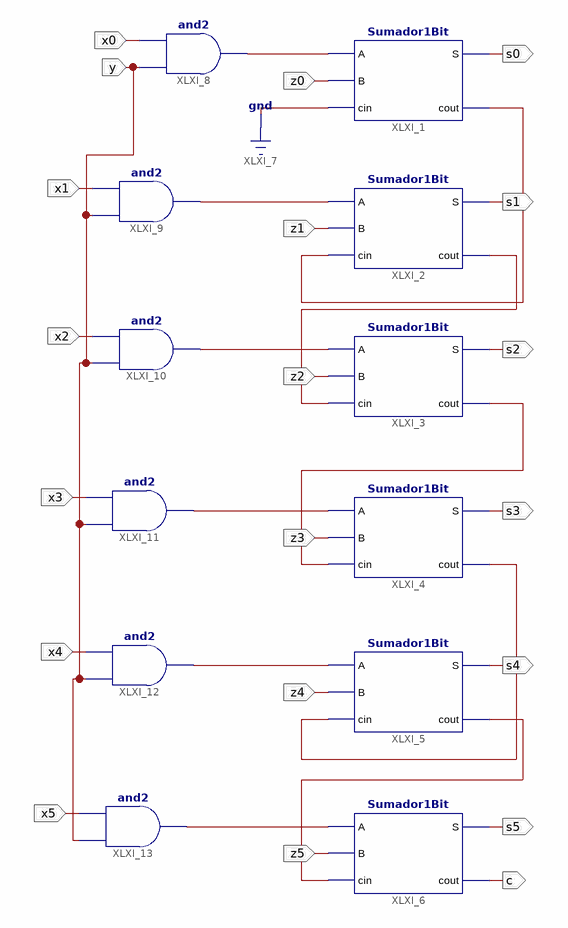
[diagram p0: schematic sheet 1]
// Xilinx ISE schematic MultiInterno.sch (spartan3e) as structural Verilog: 12 symbols, 20 ports
module MultiInterno (
  input  x0,
  input  y,
  input  x1,
  input  x2,
  input  x3,
  input  x4,
  input  x5,
  input  z0,
  input  z1,
  input  z2,
  input  z3,
  input  z4,
  input  z5,
  output c,
  output s0,
  output s1,
  output s2,
  output s3,
  output s4,
  output s5
);

  wire XLXN_1, XLXN_2, XLXN_3, XLXN_4, XLXN_8, XLXN_21, XLXN_22, XLXN_23, XLXN_24, XLXN_25, XLXN_32;

  Sumador1Bit XLXI_1 (.A(XLXN_8), .B(z0), .cin(1'b0), .S(s0), .cout(XLXN_1));
  Sumador1Bit XLXI_2 (.A(XLXN_21), .B(z1), .cin(XLXN_1), .S(s1), .cout(XLXN_2));
  Sumador1Bit XLXI_3 (.A(XLXN_22), .B(z2), .cin(XLXN_2), .S(s2), .cout(XLXN_3));
  Sumador1Bit XLXI_4 (.A(XLXN_23), .B(z3), .cin(XLXN_3), .S(s3), .cout(XLXN_32));
  Sumador1Bit XLXI_5 (.A(XLXN_24), .B(z4), .cin(XLXN_32), .S(s4), .cout(XLXN_4));
  Sumador1Bit XLXI_6 (.A(XLXN_25), .B(z5), .cin(XLXN_4), .S(s5), .cout(c));
  and XLXI_8 (XLXN_8, y, x0);
  and XLXI_9 (XLXN_21, y, x1);
  and XLXI_10 (XLXN_22, y, x2);
  and XLXI_11 (XLXN_23, y, x3);
  and XLXI_12 (XLXN_24, y, x4);
  and XLXI_13 (XLXN_25, y, x5);
endmodule
